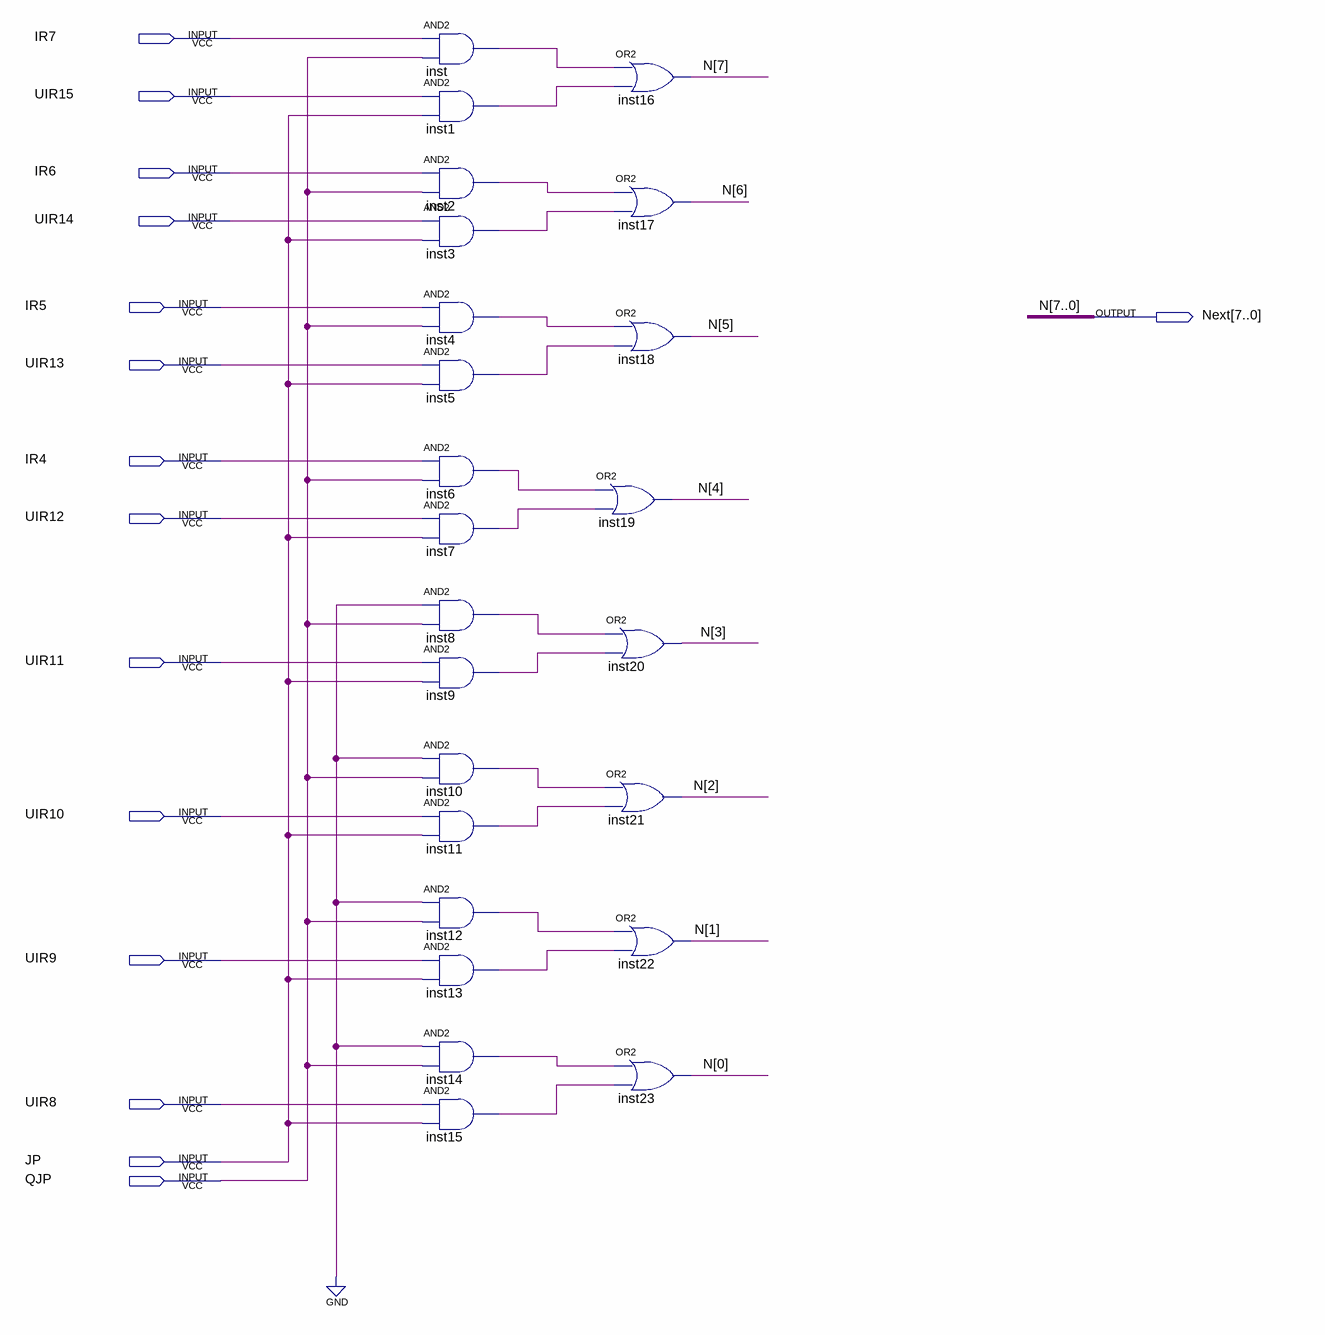
[diagram p0: schematic sheet]
// Quartus schematic NextAdr.bdf as structural Verilog: 24 symbols, 15 pins
module NextAdr (
  input  IR7,
  input  UIR15,
  input  IR6,
  input  UIR14,
  input  IR5,
  input  UIR13,
  input  IR4,
  input  UIR12,
  input  UIR11,
  input  UIR10,
  input  UIR9,
  input  UIR8,
  input  JP,
  input  QJP,
  output [7:0] Next
);

  wire inst1_out, inst2_out, inst3_out, inst4_out, inst5_out, inst6_out, inst7_out, inst8_out, inst9_out,
       inst10_out, inst11_out, inst12_out, inst13_out, inst14_out, inst15_out, inst_out;

  and inst (inst_out, IR7, QJP);
  and inst1 (inst1_out, UIR15, JP);
  and inst2 (inst2_out, IR6, QJP);
  and inst3 (inst3_out, UIR14, JP);
  and inst4 (inst4_out, IR5, QJP);
  and inst5 (inst5_out, UIR13, JP);
  and inst6 (inst6_out, IR4, QJP);
  and inst7 (inst7_out, UIR12, JP);
  and inst8 (inst8_out, 1'b0, QJP);
  and inst9 (inst9_out, UIR11, JP);
  and inst10 (inst10_out, 1'b0, QJP);
  and inst11 (inst11_out, UIR10, JP);
  and inst12 (inst12_out, 1'b0, QJP);
  and inst13 (inst13_out, UIR9, JP);
  and inst14 (inst14_out, 1'b0, QJP);
  and inst15 (inst15_out, UIR8, JP);
  or inst16 (Next[7], inst_out, inst1_out);
  or inst17 (Next[6], inst2_out, inst3_out);
  or inst18 (Next[5], inst4_out, inst5_out);
  or inst19 (Next[4], inst6_out, inst7_out);
  or inst20 (Next[3], inst8_out, inst9_out);
  or inst21 (Next[2], inst10_out, inst11_out);
  or inst22 (Next[1], inst12_out, inst13_out);
  or inst23 (Next[0], inst14_out, inst15_out);

  // Other names for the same wires on the sheet: N[7:0] = Next
endmodule
